# EAGLE design p7.1_3v3 (EAGLE 9.3.1)
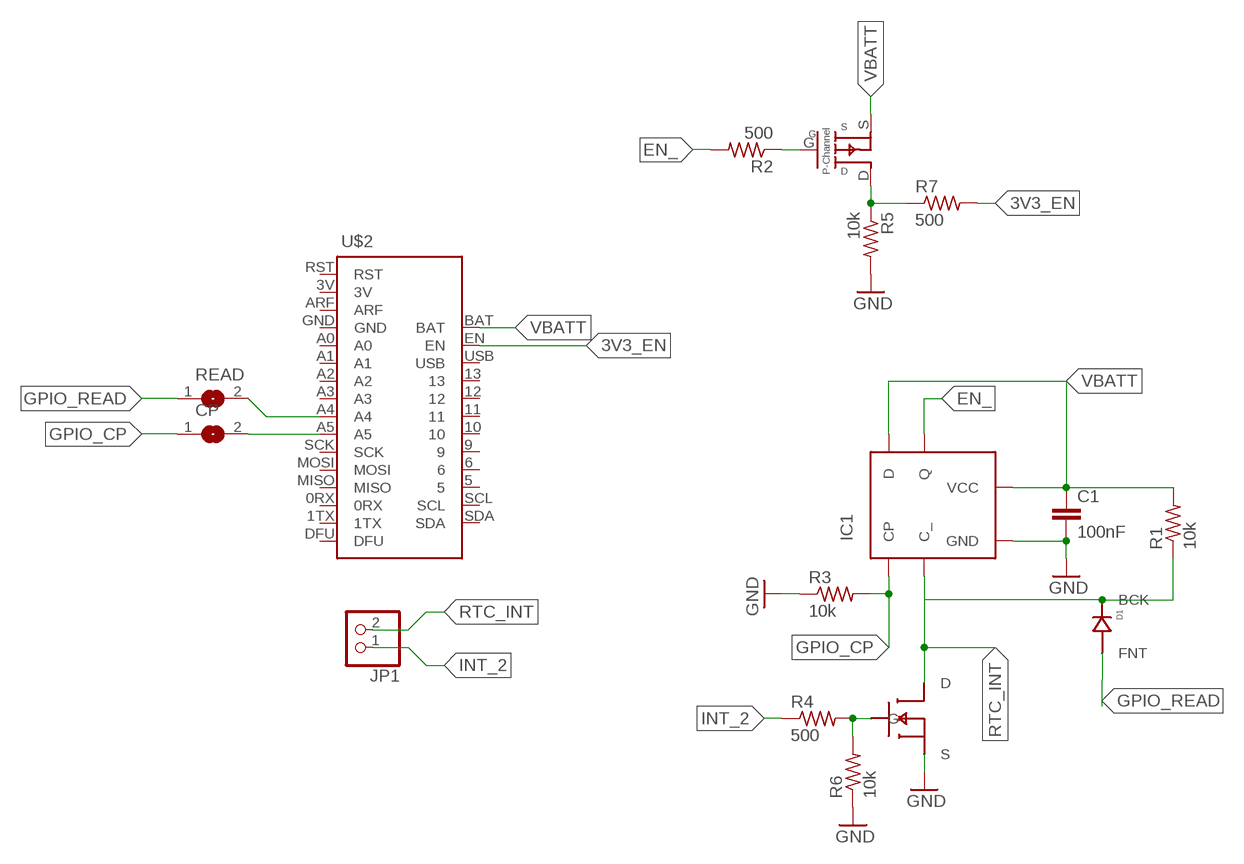
[diagram p0: schematic, sheet 1]

## Parts
C1  100nF  C  [C0805]
CP  SJ  [SJ]
D1  DIODE-DO-214AC  [DIODE-DO-214AC]
IC1  NC7SZ175  [SC70]
JP1  PINHD-1X2  [1X02]
Q1  MOSFET-SOT23F  [SOT-23F]
Q2  SSM3J3228R  [SOT-23-3]
R1  10k  R-US_R0805  [R0805]
R2  500  R-US_R0805  [R0805]
R3  10k  R-US_R0805  [R0805]
R4  500  R-US_R0805  [R0805]
R5  10k  R-US_R0805  [R0805]
R6  10k  R-US_R0805  [R0805]
R7  500  R-US_R0805  [R0805]
READ  SJ  [SJ]
U$2  BLUEFRUIT_M0  [BLUEFRUIT_MO]

## Nets
3V3_EN: R7.2 U$2.EN
EN_: IC1.Q R2.2
GND: C1.2 IC1.GND Q1.S R3.1 R5.2 R6.1
GPIO_CP [sig]: CP.1 IC1.CP R3.2
GPIO_READ [sig]: D1.FNT READ.1
INT_2: JP1.1 R4.1
N$1: Q2.G R2.1
N$2: Q1.G R4.2 R6.2
N$3: Q2.D R5.1 R7.1
N$5: READ.2 U$2.A4
N$6: CP.2 U$2.A5
RTC_INT [sig]: D1.BCK IC1.C_ JP1.2 Q1.D R1.1
VBATT [sig]: C1.1 IC1.D IC1.VCC Q2.S R1.2 U$2.BAT
Unconnected: U$2.0RX U$2.1TX U$2.3V U$2.5 U$2.6 U$2.9 U$2.10 U$2.11 U$2.12 U$2.13 U$2.A0 U$2.A1 U$2.A2 U$2.A3 U$2.ARF U$2.DFU U$2.GND U$2.MISO U$2.MOSI U$2.RST U$2.SCK U$2.SCL U$2.SDA U$2.USB

## Library data of the parts
C1 = eagle-ltspice:C: CAPACITOR, European symbol; SPICEMODEL: NONE; SPICEPREFIX: C
CP READ = jumper:SJ: SMD solder JUMPER
D1 = beach:DIODE-DO-214AC: Diode - DO-214AC, SMA
IC1 = beach:NC7SZ175
JP1 = pinhead:PINHD-1X2: PIN HEADER
Q1 = beach:MOSFET-SOT23F
Q2 = M0_Power:SSM3J3228R: P-Channel MOSFET, SOT-23-3 SMD Package
R1-R7 = resistor:R-US_: RESISTOR, American symbol
U$2 = bluefruit_m0:BLUEFRUIT_M0: Adafruit's M0 Bluefruit / Bluetooth board layout

## Net classes
3 sig: width 0.152 mm, clearance 0.152 mm

## Board
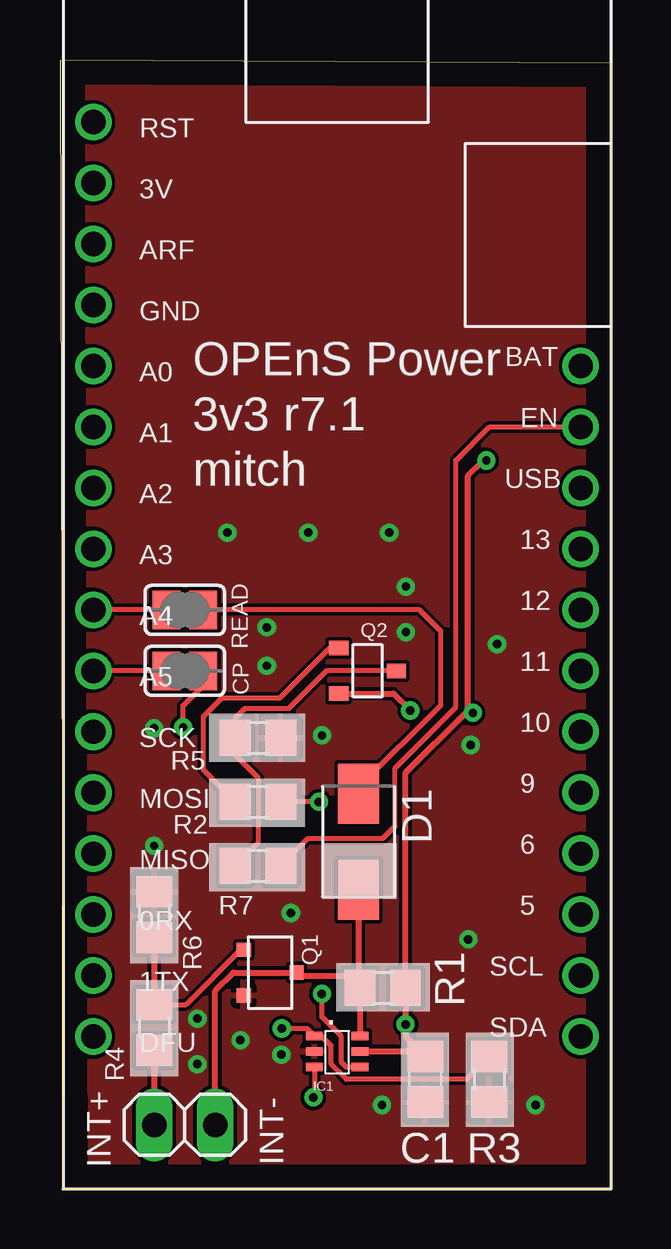
[diagram p1: board, top side]
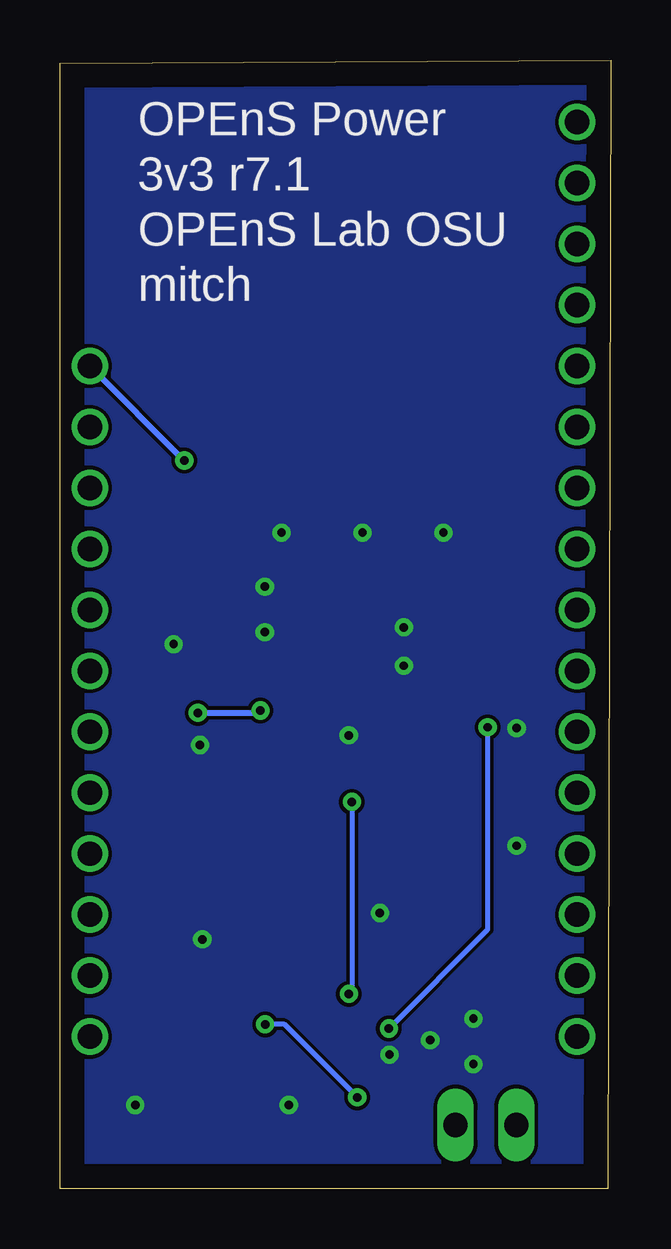
[diagram p2: board, bottom side, seen from below]

Size 22.97 x 47.04 mm. Coordinates in mm from the lower left corner, seen from the top.
Outline: 0.13,0 22.97,0 22.97,46.91 0,47.04 0.13,0
Copper layers (1*16): Top 0.035mm / dielectric 1.5mm / Bottom 0.035mm
Design rules "default": minimum track width 6mil, minimum drill 0.35mm, track to track 6mil, track to pad 6mil, pad to pad 6mil, via to via 6mil, smd to smd 6mil, copper to edge 40mil, drill to drill 6mil, minimum pad ring 10mil, minimum via ring 8mil, stop-mask expansion 4mil, vias tented up to drill 0mil, thermal gap 10mil

### Footprints (pad centres in the part's own frame; a part is rotated, then mirrored left to right if it is on the bottom)
C0805 = smd 1.3 x 1.5: 1 -0.95,0; 2 0.95,0
SJ = smd 1.168 x 1.6: 1 -0.762,0; 2 0.762,0
DIODE-DO-214AC = smd 2.5 x 1.7: BCK 2,0; FNT -2,0
SC70 = smd 0.7 x 0.35: C_ 0.95,1.3; CP -0.95,1.3; D -0.95,0; GND -0.95,0.65; Q 0.95,0; VCC 0.95,0.65
1X02 = drill 1.016 long: 1 -1.27,0; 2 1.27,0
SOT-23F = smd 0.6 x 0.6: D 0,1.1; G -0.95,-1.1; S 0.95,-1.1
SOT-23-3 = smd 0.8 x 0.6: D 1.2,0; G -1.2,0.95; S -1.2,-0.95
R0805 = smd 1.3 x 1.5: 1 -0.95,0; 2 0.95,0
BLUEFRUIT_MO = drill 1.016: 0RX 39.37,1.27; 1TX 41.91,1.27; 3V 8.89,1.27; 5 39.37,21.59; 6 36.83,21.59; 9 34.29,21.59; 10 31.75,21.59; 11 29.21,21.59; 12 26.67,21.59; 13 24.13,21.59; A0 16.51,1.27; A1 19.05,1.27; A2 21.59,1.27; A3 24.13,1.27; A4 26.67,1.27; A5 29.21,1.27; ARF 11.43,1.27; BAT 16.51,21.59; DFU 44.45,1.27; EN 19.05,21.59; GND 13.97,1.27; MISO 36.83,1.27; MOSI 34.29,1.27; RST 6.35,1.27; SCK 31.75,1.27; SCL 41.91,21.59; SDA 44.45,21.59; USB 21.59,21.59

### Placement (x,y rotation side)
C1  15.24,4.57 270 top
CP  5.21,21.59 180 top
D1  12.45,14.48 270 top
IC1  11.56,5.08 0 top
JP1  5.21,2.67 0 top
Q1  8.76,9.02 270 top
Q2  12.83,21.59 0 top
R1  13.46,8.38 0 top
R2  8.26,16.13 0 top
R3  17.91,4.57 90 top
R4  3.94,6.73 90 top
R5  8.26,18.8 0 top
R6  3.94,11.43 270 top
R7  8.26,13.46 0 top
READ  5.21,24.13 180 top
U$2  0.13,50.8 270 top

### Tracks (layer width: path | path; a pad name or v marks a point on that pad's centre or on a via)
3V3_EN
  Top 0.203: R7.2 10.35,14.61 13.46,14.61 13.97,15.11 13.97,17.53 16.51,20.07 16.51,30.35 17.91,31.75 U$2.EN
EN_  (via drill 0.35)
  Top 0.203: IC1.Q 11.94,5.08 11.74,5.28 11.74,6.35 10.92,7.17 v10.92,8.13 | v10.79,16.13 R2.2
  Bottom 0.203: v10.79,16.13 10.79,8.26 v10.92,8.13
GND  (via drill 0.35)
  other vias: 13.73,27.35 10.35,27.35 6.98,27.35 10.93,18.9 17.13,18.5 3.93,19.2 3.93,14.3 17.03,10.4 9.23,5.6 13.43,3.5 19.83,3.5 8.63,23.4 8.63,21.8 14.43,25.1 14.43,23.2 18.23,22.7 9.63,11.5 5.73,7.1 5.73,5.2 7.53,6.2
  pour Top: 0.13,0 23.03,0 23.03,46.9 0.13,46.9
  pour Bottom: 0.13,0 22.93,0 22.93,46.9 0.13,46.9
GPIO_CP  (via drill 0.35)
  Top 0.152: 10.89,6.38 IC1.CP
  Top 0.203: R3.2 16.96,4.57 11.94,4.57 11.3,5.21 11.3,5.97 10.89,6.38 | IC1.CP 10.3,6.68 v9.25,6.68 | v5.13,19.24 5.13,20.14 5.97,20.97 CP.1
  Bottom 0.203: v9.25,6.68 5.13,10.8 v5.13,19.24
GPIO_READ
  Top 0.203: D1.FNT 12.45,16.73 15.88,20.16 15.88,23.24 14.99,24.13 READ.1
INT_2
  Top 0.254: R4.1 JP1.1
N$1
  Top 0.203: Q2.G 11.25,22.54 9.15,20.45 6.73,20.45 5.97,19.68 5.97,17.46 R2.1
N$2
  Top 0.203: R4.2 5.25,7.68 7.54,9.97 Q1.G
  Top 0.254: R6.2 R4.2
N$3
  Top 0.203: R7.1 8.26,14.41 8.26,17.14 7.3,18.09 R5.1 7.3,19.62 7.7,20.02 9.53,20.02 11.11,21.59 Q2.D
N$5
  Top 0.203: READ.2 U$2.A4
N$6
  Top 0.203: CP.2 U$2.A5
RTC_INT
  Top 0.152: R1.1 12.51,7.62 12.45,7.69 12.45,8.89 | IC1.C_ | 9.99,8.89 9.88,8.99 Q1.D
  Top 0.254: 12.51,7.62 IC1.C_ | D1.BCK 12.45,8.89 9.99,8.89 | JP1.2 6.48,8.26 7.24,9.02 Q1.D
VBATT  (via drill 0.35)
  Top 0.152: 15.03,5.73 C1.1 | 10.61,3.86 v10.57,3.82
  Top 0.203: IC1.D 10.61,3.86
  Top 0.254: IC1.VCC 15.03,5.73 | C1.1 14.41,6.35 v14.41,6.86 R1.2 14.41,17.33 16.92,19.84 | 16.92,19.84 17.02,19.94 17.02,29.72 17.65,30.35 v17.78,30.35 | Q2.S 13.9,20.64 v14.61,19.94 | v17.22,19.84 16.92,19.84
  Bottom 0.203: v10.57,3.82 13.61,6.86 v14.41,6.86
  Bottom 0.254: v17.78,30.35 U$2.BAT | v17.22,19.84 14.71,19.84 v14.61,19.94

### Text on the board
tPlace: OPEnS Power | 3v3 r7.1 | mitch | INT+ | INT-
bPlace: OPEnS Power | 3v3 r7.1 | OPEnS Lab OSU | mitch